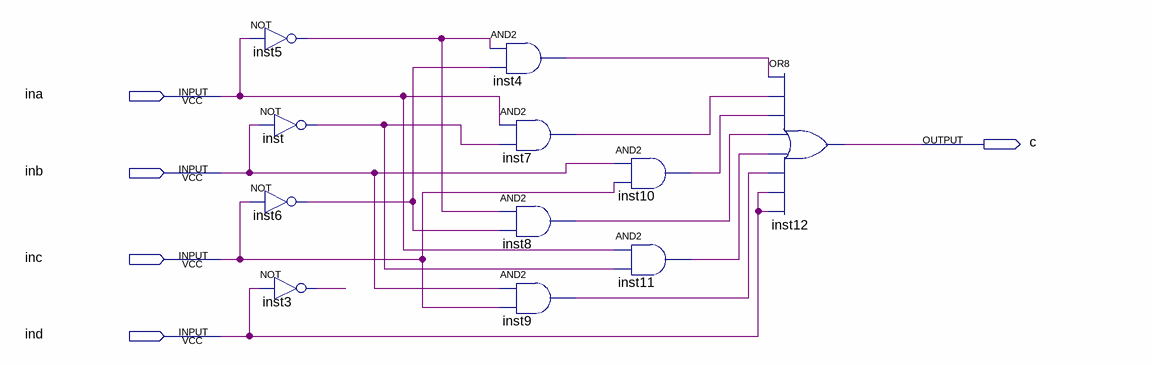
[diagram p0: schematic sheet]
// Quartus schematic c.bdf as structural Verilog: 11 symbols, 5 pins
module c (
  input  ina,
  input  inb,
  input  inc,
  input  ind,
  output c
);

  wire inst3_out, inst4_out, inst5_out, inst6_out, inst7_out, inst8_out, inst9_out, inst10_out, inst11_out,
       inst_out;

  not inst5 (inst5_out, ina);
  not inst (inst_out, inb);
  not inst6 (inst6_out, inc);
  not inst3 (inst3_out, ind);
  and inst4 (inst4_out, inst5_out, inst6_out);
  and inst7 (inst7_out, ina, inst_out);
  and inst8 (inst8_out, inst5_out, inst6_out);
  and inst9 (inst9_out, inb, inc);
  and inst10 (inst10_out, inb, inc);
  and inst11 (inst11_out, ina, inst_out);
  or inst12 (c, inst4_out, inst7_out, inst10_out, inst8_out, inst11_out, inst9_out, ind, ind);
endmodule
